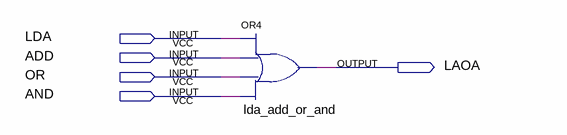
[diagram p0: schematic sheet]
// Quartus schematic or_LAOA.bdf as structural Verilog: 1 symbols, 5 pins
module or_LAOA (
  input  LDA,
  input  ADD,
  input  OR,
  input  AND,
  output LAOA
);

  or lda_add_or_and (LAOA, LDA, ADD, OR, AND);
endmodule
